# Altium project IRN.PrjPcb
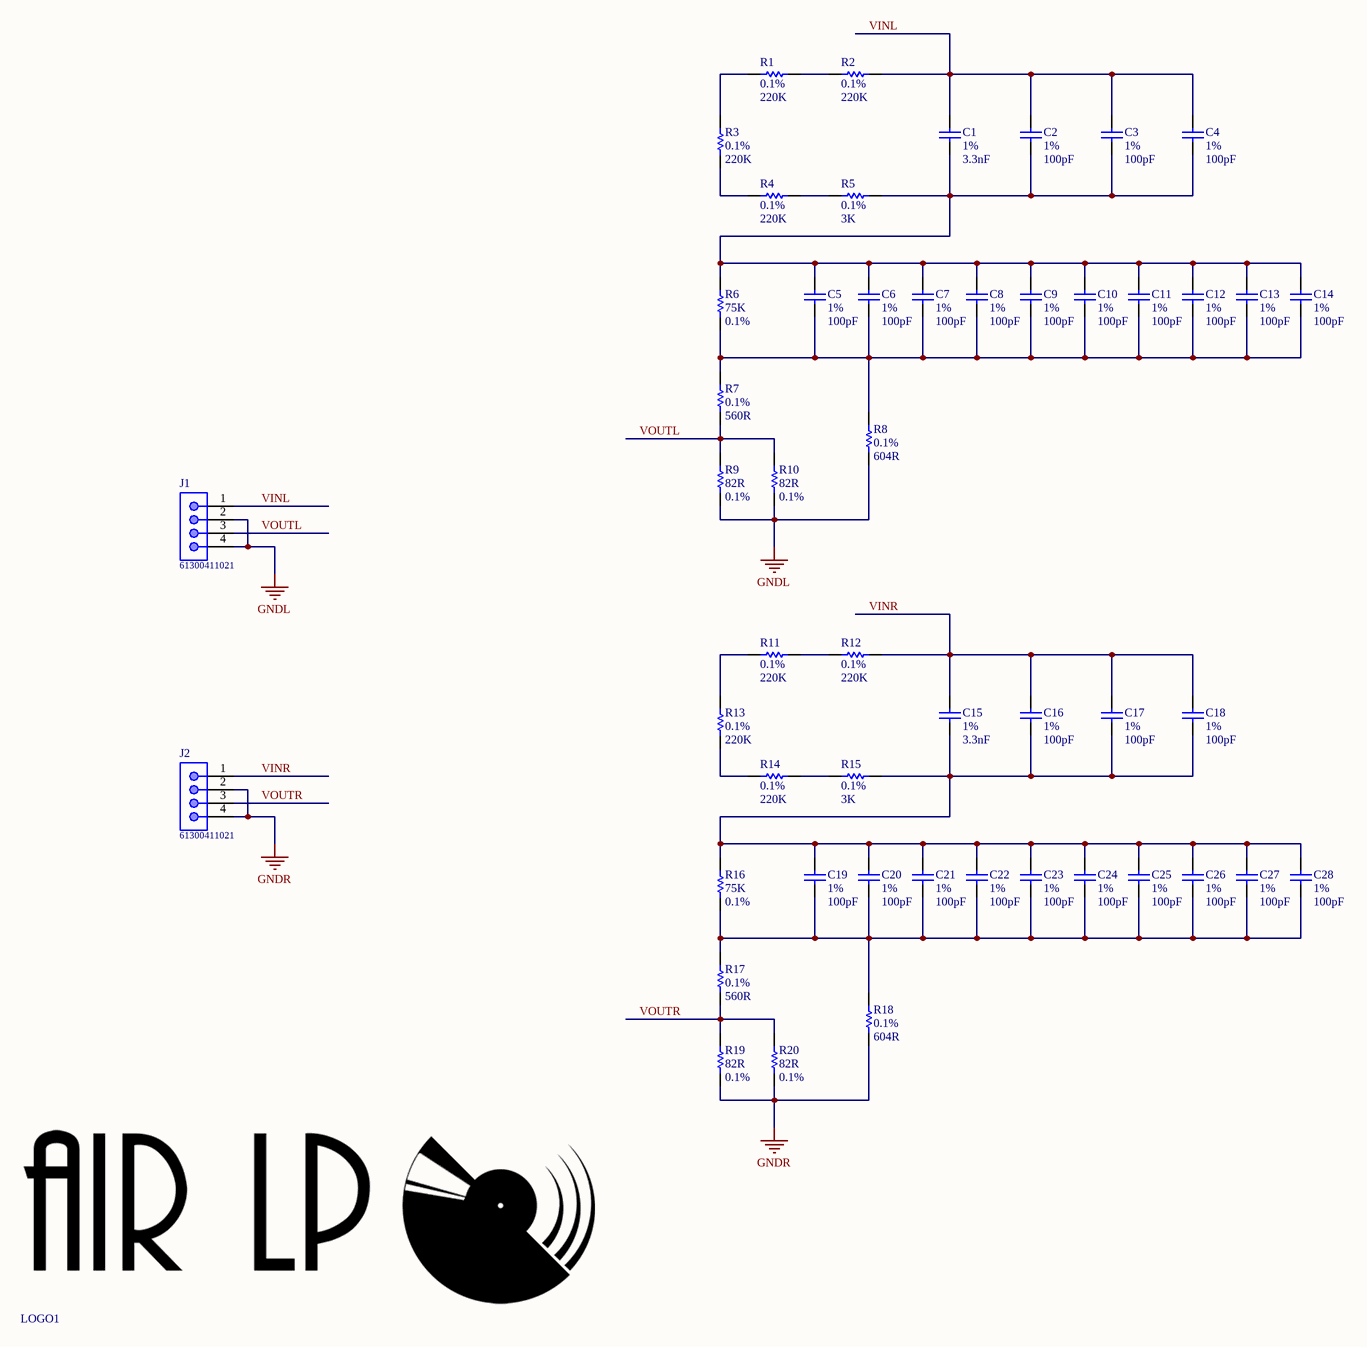
[diagram p0: IRN.SchDoc]
1 sheet, 51 parts. Net scope: global (net labels, ports and power ports of the same name join across sheets).
Board file: IRN.PcbDoc

## Sheet IRN.SchDoc
size A3

### Parts
C1  value 3.3nF  Tolerance: 1%  [CAPC0603(1608)100_L]  (hidden comment: CAP0603)
C2  value 100pF  Tolerance: 1%  [CAPC0603(1608)100_L]  (hidden comment: CAP0603)
C3  value 100pF  Tolerance: 1%  [CAPC0603(1608)100_L]  (hidden comment: CAP0603)
C4  value 100pF  Tolerance: 1%  [CAPC0603(1608)100_L]  (hidden comment: CAP0603)
C5  value 100pF  Tolerance: 1%  [CAPC0603(1608)100_L]  (hidden comment: CAP0603)
C6  value 100pF  Tolerance: 1%  [CAPC0603(1608)100_L]  (hidden comment: CAP0603)
C7  value 100pF  Tolerance: 1%  [CAPC0603(1608)100_L]  (hidden comment: CAP0603)
C8  value 100pF  Tolerance: 1%  [CAPC0603(1608)100_L]  (hidden comment: CAP0603)
C9  value 100pF  Tolerance: 1%  [CAPC0603(1608)100_L]  (hidden comment: CAP0603)
C10  value 100pF  Tolerance: 1%  [CAPC0603(1608)100_L]  (hidden comment: CAP0603)
C11  value 100pF  Tolerance: 1%  [CAPC0603(1608)100_L]  (hidden comment: CAP0603)
C12  value 100pF  Tolerance: 1%  [CAPC0603(1608)100_L]  (hidden comment: CAP0603)
C13  value 100pF  Tolerance: 1%  [CAPC0603(1608)100_L]  (hidden comment: CAP0603)
C14  value 100pF  Tolerance: 1%  [CAPC0603(1608)100_L]  (hidden comment: CAP0603)
C15  value 3.3nF  Tolerance: 1%  [CAPC0603(1608)100_L]  (hidden comment: CAP0603)
C16  value 100pF  Tolerance: 1%  [CAPC0603(1608)100_L]  (hidden comment: CAP0603)
C17  value 100pF  Tolerance: 1%  [CAPC0603(1608)100_L]  (hidden comment: CAP0603)
C18  value 100pF  Tolerance: 1%  [CAPC0603(1608)100_L]  (hidden comment: CAP0603)
C19  value 100pF  Tolerance: 1%  [CAPC0603(1608)100_L]  (hidden comment: CAP0603)
C20  value 100pF  Tolerance: 1%  [CAPC0603(1608)100_L]  (hidden comment: CAP0603)
C21  value 100pF  Tolerance: 1%  [CAPC0603(1608)100_L]  (hidden comment: CAP0603)
C22  value 100pF  Tolerance: 1%  [CAPC0603(1608)100_L]  (hidden comment: CAP0603)
C23  value 100pF  Tolerance: 1%  [CAPC0603(1608)100_L]  (hidden comment: CAP0603)
C24  value 100pF  Tolerance: 1%  [CAPC0603(1608)100_L]  (hidden comment: CAP0603)
C25  value 100pF  Tolerance: 1%  [CAPC0603(1608)100_L]  (hidden comment: CAP0603)
C26  value 100pF  Tolerance: 1%  [CAPC0603(1608)100_L]  (hidden comment: CAP0603)
C27  value 100pF  Tolerance: 1%  [CAPC0603(1608)100_L]  (hidden comment: CAP0603)
C28  value 100pF  Tolerance: 1%  [CAPC0603(1608)100_L]  (hidden comment: CAP0603)
J1  61300411021  [61300411021]
J2  61300411021  [61300411021]
LOGO1  LOGO-AIRLP  [LOGO-AIR-LP]  (value not drawn)
R1  value 220K  Tolerance: 0.1%  [RESC0805(2012)_L]  (hidden comment: RES0805)
R2  value 220K  Tolerance: 0.1%  [RESC0805(2012)_L]  (hidden comment: RES0805)
R3  value 220K  Tolerance: 0.1%  [RESC0805(2012)_L]  (hidden comment: RES0805)
R4  value 220K  Tolerance: 0.1%  [RESC0805(2012)_L]  (hidden comment: RES0805)
R5  value 3K  Tolerance: 0.1%  [RESC0805(2012)_L]  (hidden comment: RES0805)
R6  value 75K  Tolerance: 0.1%  [RESC0603(1608)_L]  (hidden comment: RES0603)
R7  value 560R  Tolerance: 0.1%  [RESC0805(2012)_L]  (hidden comment: RES0805)
R8  value 604R  Tolerance: 0.1%  [RESC0805(2012)_L]  (hidden comment: RES0805)
R9  value 82R  Tolerance: 0.1%  [RESC0603(1608)_L]  (hidden comment: RES0603)
R10  value 82R  Tolerance: 0.1%  [RESC0603(1608)_L]  (hidden comment: RES0603)
R11  value 220K  Tolerance: 0.1%  [RESC0805(2012)_L]  (hidden comment: RES0805)
R12  value 220K  Tolerance: 0.1%  [RESC0805(2012)_L]  (hidden comment: RES0805)
R13  value 220K  Tolerance: 0.1%  [RESC0805(2012)_L]  (hidden comment: RES0805)
R14  value 220K  Tolerance: 0.1%  [RESC0805(2012)_L]  (hidden comment: RES0805)
R15  value 3K  Tolerance: 0.1%  [RESC0805(2012)_L]  (hidden comment: RES0805)
R16  value 75K  Tolerance: 0.1%  [RESC0603(1608)_L]  (hidden comment: RES0603)
R17  value 560R  Tolerance: 0.1%  [RESC0805(2012)_L]  (hidden comment: RES0805)
R18  value 604R  Tolerance: 0.1%  [RESC0805(2012)_L]  (hidden comment: RES0805)
R19  value 82R  Tolerance: 0.1%  [RESC0603(1608)_L]  (hidden comment: RES0603)
R20  value 82R  Tolerance: 0.1%  [RESC0603(1608)_L]  (hidden comment: RES0603)

### Nets
GNDL: J1.2 J1.4 R8.2 R9.2 R10.2
GNDR: J2.2 J2.4 R18.2 R19.2 R20.2
VINL: C1.2 C2.2 C3.2 C4.2 J1.1 R2.2
VINR: C15.2 C16.2 C17.2 C18.2 J2.1 R12.2
VOUTL: J1.3 R7.2 R9.1 R10.1
VOUTR: J2.3 R17.2 R19.1 R20.1
NetC1_1: C1.1 C2.1 C3.1 C4.1 C5.2 C6.2 C7.2 C8.2 C9.2 C10.2 C11.2 C12.2 C13.2 C14.2 R5.2 R6.1
NetC5_1: C5.1 C6.1 C7.1 C8.1 C9.1 C10.1 C11.1 C12.1 C13.1 C14.1 R6.2 R7.1 R8.1
NetC15_1: C15.1 C16.1 C17.1 C18.1 C19.2 C20.2 C21.2 C22.2 C23.2 C24.2 C25.2 C26.2 C27.2 C28.2 R15.2 R16.1
NetC19_1: C19.1 C20.1 C21.1 C22.1 C23.1 C24.1 C25.1 C26.1 C27.1 C28.1 R16.2 R17.1 R18.1
NetR1_1: R1.1 R3.1
NetR1_2: R1.2 R2.1
NetR3_2: R3.2 R4.1
NetR4_2: R4.2 R5.1
NetR11_1: R11.1 R13.1
NetR11_2: R11.2 R12.1
NetR13_2: R13.2 R14.1
NetR14_2: R14.2 R15.1

### Library data of the parts
C1-C28 = CMP-1590-00005-1: 0603 (1608 Metric) Chip Capacitor; Case-Metric: 1608; Case-EIA: 0603; PackageReference: CAPC0603(1608)100
  C1 C15: Farnell: 2904728
  C2-C14 C16-C28: Farnell: 2332598
J1 J2 = 61300411021: THT Angled Pin Header WR-PHD, Pitch 2.54 mm, Single Row, 4 pins; Pin Number: 4; Pitch: 2.54 mm; Gender: Male; Rated Current: 3 A; Working Voltage: 250 VAC; Withstanding Voltage: 500 VAC; Contact Resistance: 20 mOhm; ComponentLink1Description: Manufacturer; ComponentLink1URL: http://www.we-online.de; ComponentLink2Description: Datasheet; ComponentLink2URL: https://katalog.we-online.de/em/datasheet/6130xx11021.pdf; Part Number: 61300411021; Published Date: August 2018; Publisher: Wurth Elektronik; Operating Temperature: -40 to 105 degC; Mounting Technology: THT; Packaging: Bag; Row Number: Single; Orientation: Angled
LOGO1 = LOGO-AIRLP: LOGO AIR LP
R1-R5 R7 R8 R11-R15 R17 R18 = CMP-1591-00002-1: 0805 (2012 Metric) Chip Resistor; Case-EIA: 0805; Case-Metric: 2012; PackageReference: RESC0805(2012)
  R1-R4 R11-R14: Farnell: 1577690
  R5 R15: Farnell: 1670234
  R7 R17: Farnell: 1577655
  R8 R18: Farnell: 1810482
R6 R9 R10 R16 R19 R20 = CMP-1591-00001-1: 0603 (1608 Metric) Chip Resistor; Case-Metric: 1608; Case-EIA: 0603; PackageReference: RESC0603(1608)
  R6 R16: Farnell: 1670201
  R9 R10 R19 R20: Farnell: 1577592